# Altium schematic sheet iRat_2.1_Microcontroller.SchDoc
size A4
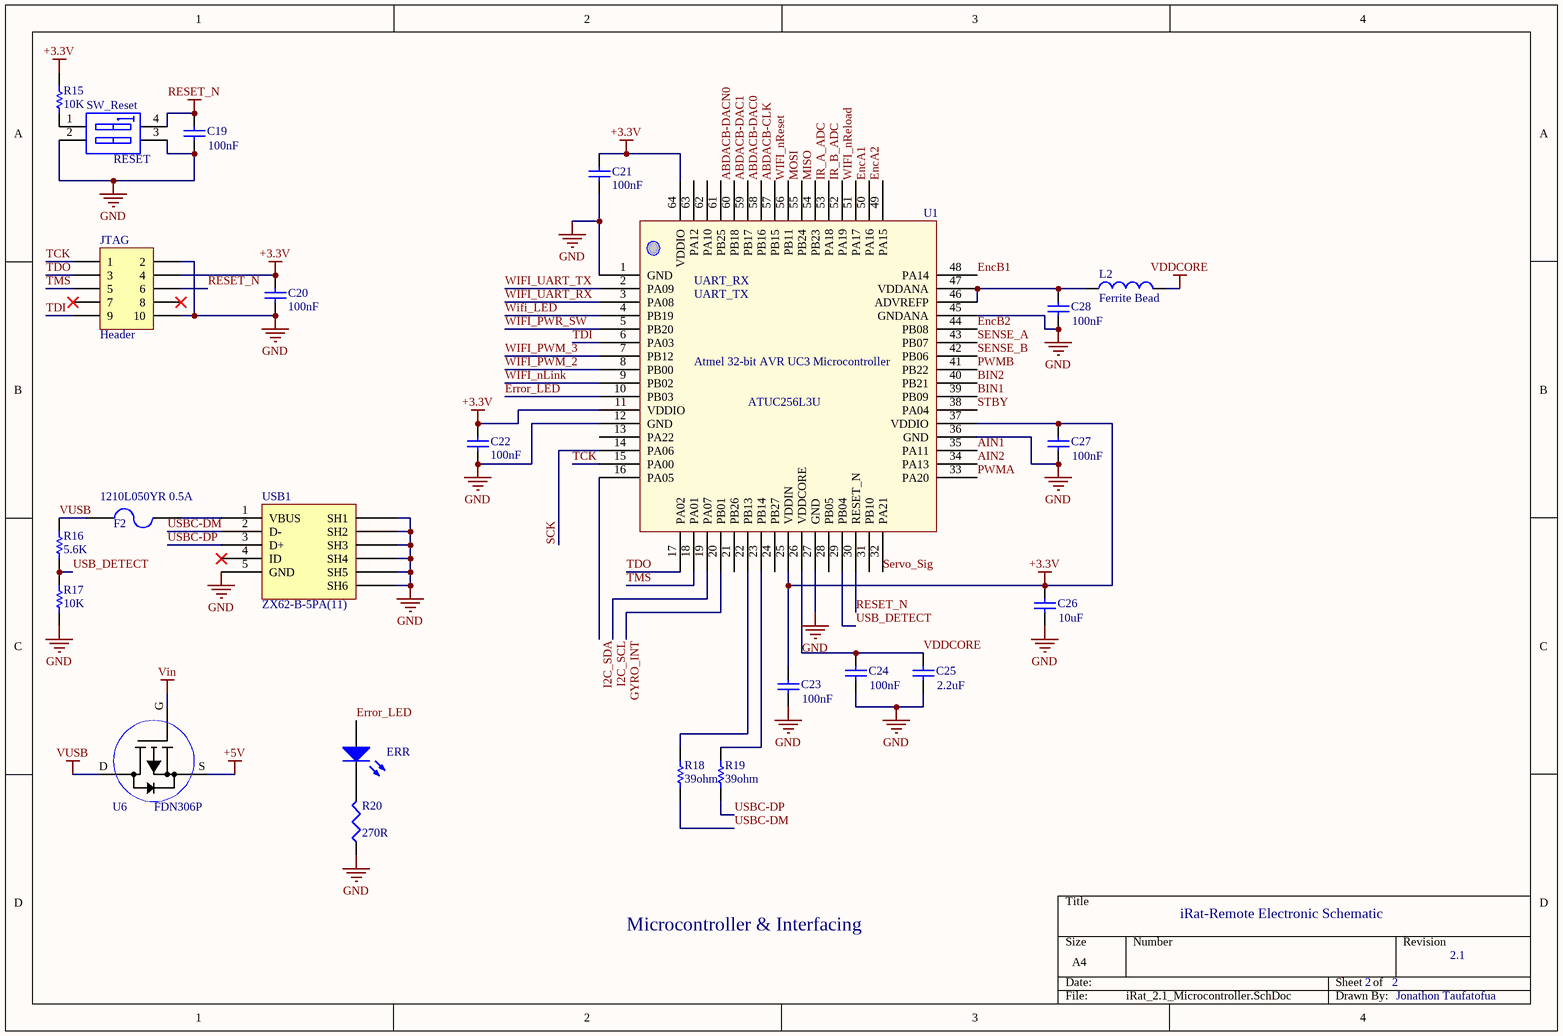
[diagram p0: iRat_2.1_Microcontroller.SchDoc]

## Parts
C19  value 100nF  [1608[0603]]  (hidden comment: Cap Semi)
C20  value 100nF  [1608[0603]]  (hidden comment: Cap Semi)
C21  value 100nF  [1608[0603]]  (hidden comment: Cap Semi)
C22  value 100nF  [1608[0603]]  (hidden comment: Cap Semi)
C23  value 100nF  [1608[0603]]  (hidden comment: Cap Semi)
C24  value 100nF  [1608[0603]]  (hidden comment: Cap Semi)
C25  value 2.2uF  [C1206]  (hidden comment: Cap Semi)
C26  value 10uF  [C1206]
C27  value 100nF  [1608[0603]]  (hidden comment: Cap Semi)
C28  value 100nF  [1608[0603]]  (hidden comment: Cap Semi)
ERR  LNJ347W83RA  [0402-A]  (value not drawn)
F2  1210L050YR 0.5A  [14-1210]
JTAG  Header  [HDR2X5]
L2  Ferrite Bead  [0805E]
R15  value 10K  [0402]
R16  value 5.6K  [0402]  (hidden comment: Res Semi)
R17  value 10K  [0402]  (hidden comment: Res Semi)
R18  value 39ohm  [0603E]  (hidden comment: Res1)
R19  value 39ohm  [0603E]  (hidden comment: Res1)
R20  value 270R  [0402]  (hidden comment: Res3)
SW_Reset  RESET  [SW16]
U1  ATUC256L3U-AUT  [TQFP64_M]  (value not drawn)
U6  FDN306P  [FDN306P]
USB1  ZX62-B-5PA(11)  [ZX62-B-5PA(11)]

## Nets
+3.3V: C20.1 C21.2 C22.2 C23.2 C26.2 C27.2 JTAG.4 R15.1 U1.11(VDDIO) U1.25(VDDIN) U1.37(VDDIO) U1.64(VDDIO)
+5V: U6.S
GND: C19.1 C20.2 C21.1 C22.1 C23.1 C24.1 C25.1 C26.1 C27.1 C28.1 JTAG.2 JTAG.10 R17.1 R20.1 SW_Reset.2 SW_Reset.3 U1.1(GND) U1.12(GND) U1.27(GND) U1.36(GND) U1.45(GNDANA) USB1.5(GND) USB1.SH1 USB1.SH2 USB1.SH3 USB1.SH4 USB1.SH5 USB1.SH6
RESET_N: C19.2 JTAG.6 SW_Reset.4 U1.30(RESET_N)
VDDCORE: C24.2 C25.2 L2.2 U1.26(VDDCORE)
Vin: U6.G
VUSB: F2.2 R16.2 U6.D
ABDACB-CLK: U1.57(PB15)
ABDACB-DAC0: U1.58(PB16)
ABDACB-DAC1: U1.59(PB17)
ABDACB-DACN0: U1.60(PB18)
AIN1: U1.35(PA11)
AIN2: U1.34(PA13)
BIN1: U1.39(PB09)
BIN2: U1.40(PB21)
EncA1: U1.50(PA16)
EncA2: U1.49(PA15)
EncB1: U1.48(PA14)
EncB2: U1.44(PB08)
Error_LED: ERR.1(A) U1.10(PB03)
GYRO_INT: U1.20(PB01)
I2C_SCL: U1.19(PA07)
I2C_SDA: U1.16(PA05)
IR_A_ADC: U1.53(PA18)
IR_B_ADC: U1.52(PA19)
MISO: U1.54(PB23)
MOSI: U1.55(PB24)
PWMA: U1.33(PA20)
PWMB: U1.41(PB22)
SCK: U1.14(PA06)
SENSE_A: U1.43(PB07)
SENSE_B: U1.42(PB06)
Servo_Sig: U1.32(PA21)
STBY: U1.38(PA04)
TCK: JTAG.1 U1.15(PA00)
TDI: JTAG.9 U1.6(PA03)
TDO: JTAG.3 U1.17(PA02)
TMS: JTAG.5 U1.18(PA01)
USB_DETECT: R16.1 R17.2 U1.29(PB04)
USBC-DM: R18.2 USB1.2(D-)
USBC-DP: R19.2 USB1.3(D+)
Wifi_LED: U1.4(PB19)
WIFI_nLink: U1.9(PB02)
WIFI_nReload: U1.51(PA17)
WIFI_nReset: U1.56(PB11)
WIFI_PWM_2: U1.8(PB00)
WIFI_PWM_3: U1.7(PB12)
WIFI_PWR_SW: U1.5(PB20)
WIFI_UART_RX: U1.3(PA08)
WIFI_UART_TX: U1.2(PA09)
NetC28_2: C28.2 L2.1 U1.46(ADVREFP) U1.47(VDDANA)
NetERR_2: ERR.2(K) R20.2
NetF2_1: F2.1 USB1.1(VBUS)
NetR15_2: R15.2 SW_Reset.1
NetR18_1: R18.1 U1.22(PB13)
NetR19_1: R19.1 U1.23(PB14)

Not connected (* = marked no-connect by the designer): JTAG 7* 8*; U1 13(PA22) 21(PB26) 24(PB27) 28(PB05) 31(PB10) 61(PB25) 62(PA10) 63(PA12); USB1 4(ID)*

## Notes on the sheet
- (near U1) UART_TX
- (near U1) UART_RX
- iRat-Remote Electronic Schematic
- Microcontroller & Interfacing
- 2
- 2.1
- Jonathon Taufatofua
- (in symbol ATUC256L3U-AUT) ATUC256L3U

## Library data of the parts
C19-C28 = Cap Semi: Capacitor (Semiconductor SIM Model); Published: 8-Jun-2000; LatestRevisionDate: 29-May-2009; LatestRevisionNote: IPC-7351 Footprint Added.; PackageReference: C1206; Publisher: Altium Limited; PackageDescription: Chip Capacitor
ERR = LED2: GREEN Wifi LED; Published: 8-Jun-2000; LatestRevisionDate: 17-Jul-2002; LatestRevisionNote: Re-released for DXP Platform.; PackageVersion: Feb-2002; PackageReference: 3.2X1.6X1.1; Publisher: Altium Limited; PackageDescription: SM LED; 2 Flat Leads
F2 = Fuse 2: Fuse; Published: 8-Jun-2000; LatestRevisionDate: 17-Jul-2002; LatestRevisionNote: Re-released for DXP Platform.; PackageReference: PIN-W2/E2.8; Publisher: Altium Limited; PackageDescription: Thru-Hole; 2 Leads
JTAG = Header 5X2: Header, 5-Pin, Dual row; LatestRevisionDate: 17-Jul-2002; LatestRevisionNote: Re-released for DXP Platform.; Publisher: Altium Limited
L2 = Inductor: MLS0805-4S7-301; Code_IEC: 1005; Published: 8-Jun-2000; LatestRevisionDate: 29-May-2009; LatestRevisionNote: IPC-7351 Footprint Added.; PackageReference: 0402-A; Publisher: Altium Limited; PackageDescription: Chip Inductor; Code_JEITA: 0402
R15-R17 = Res Semi: Semiconductor Resistor; Published: 8-Jun-2000; LatestRevisionDate: 17-Jul-2002; LatestRevisionNote: Re-released for DXP Platform.; PackageReference: AXIAL-0.5; Publisher: Altium Limited; PackageDescription: Axial Device, Thru-Hole; 2 Leads; 0.5 in Pin Spacing
R18 R19 = Res1: Resistor; Published: 8-Jun-2000; LatestRevisionDate: 17-Jul-2002; LatestRevisionNote: Re-released for DXP Platform.; PackageReference: AXIAL-0.3; Publisher: Altium Limited; PackageDescription: Axial Device, Thru-Hole; 2 Leads; 0.3 in Pin Spacing
R20 = Res3: Resistor; Published: 8-Jun-2000; LatestRevisionDate: 29-May-2009; LatestRevisionNote: IPC-7351 Footprint Added.; PackageReference: J1-0603; Publisher: Altium Limited; PackageDescription: Chip Resistor
SW_Reset = SW DIP-2: DIP Switch, 2 Position, SPST; pin to pad: 3>2 4>1; Published: 24-Mar-1999; LatestRevisionDate: 17-Jul-2002; LatestRevisionNote: Re-released for DXP Platform.; PackageReference: DIP-4; Publisher: Altium Limited
U1 = ATUC256L3U-AUT: Atmel 32-bit AVR UC3 Microcontroller
USB1 = ZX62-B-5PA(11): Micro-B USB Receptacle